# EAGLE design robot (EAGLE 9.2.2)
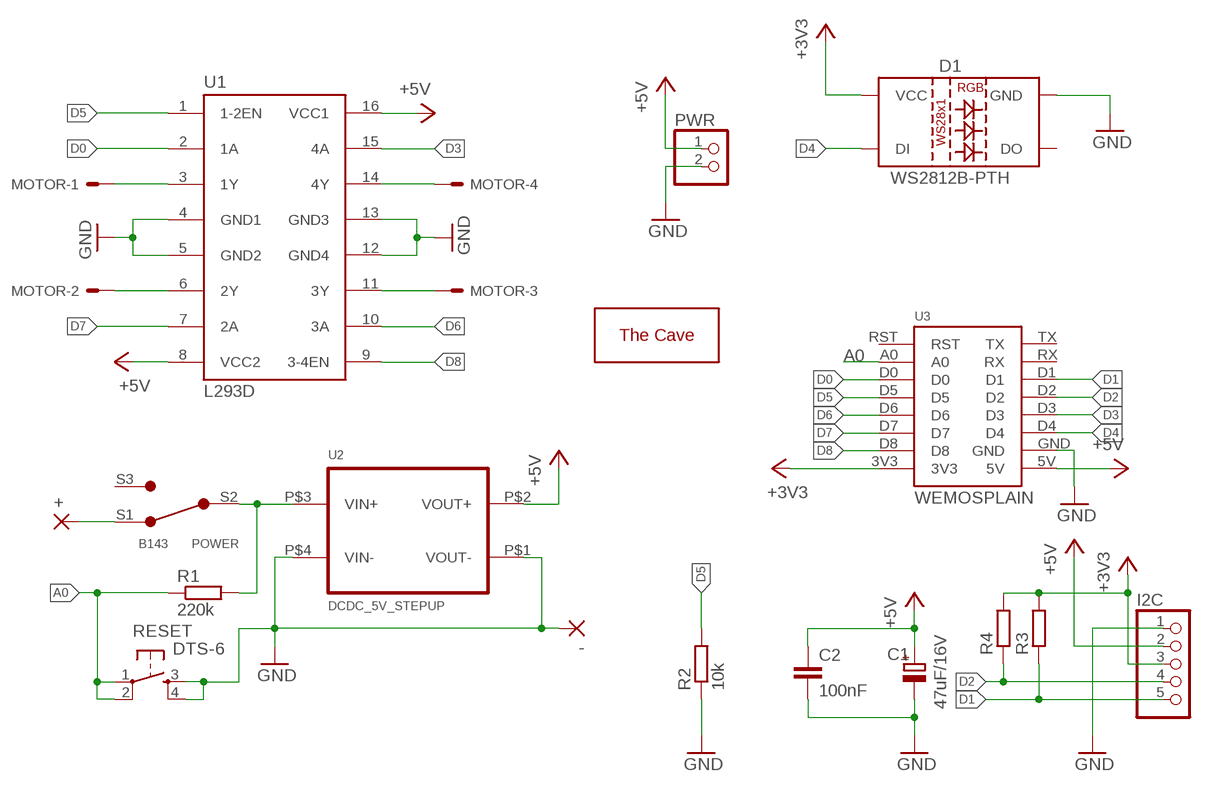
[diagram p0: schematic, sheet 1]

## Parts
+  2,54/0,8  [2,54/0,8]
-  2,54/0,8  [2,54/0,8]
C1  47uF/16V  CPOL-EUE2.5-7  [E2,5-7]
C2  100nF  C-EU025-025X050  [C025-025X050]
D1  WS2812B-PTH  [WS2812B-PTH-KIT]
I2C  PINHD-1X5  [1X05]
MOTOR  JST-XH-04-PIN-LONG-PAD  [JST-XH-04-PACKAGE-LONG-PAD]
POWER  B143  [B143]
PWR  PINHD-1X2  [1X02]
R1  220k  R-EU_0204/5  [0204/5]
R2  10k  R-EU_0204/5  [0204/5]
R3  R-EU_R0805  [R0805]
R4  R-EU_R0805  [R0805]
RESET  DTS-6  [DTS-6]
U1  L293D  [DIL16]
U2  DCDC_5V_STEPUP  [DCDC_5V_STEPUP]
U3  WEMOSPLAIN  [WEMOS-PLAIN]
U$1  THECAVE_LOGO_NEW_TOP_SMALL  [NEW_LOGO_SMALL_TOP]

## Nets
+3V3: D1.3-VCC(VCC) I2C.3 R3.2 R4.2 U3.3V3
+5V: C1.+ C2.1 I2C.2 PWR.1 U1.8(VCC2) U1.16(VCC1) U2.P$2(VOUT+) U3.5V
A0: R1.1 RESET.1 RESET.2 U3.A0
D0: U1.2(1A) U3.D0
D1: I2C.5 R3.1 U3.D1
D2: I2C.4 R4.1 U3.D2
D3: U1.15(4A) U3.D3
D4: D1.1-IN(DI) U3.D4
D5: R2.2 U1.1(1-2EN) U3.D5
D6: U1.10(3A) U3.D6
D7: U1.7(2A) U3.D7
D8: U1.9(3-4EN) U3.D8
GND: -.1(P) C1.- C2.2 D1.2-GND(GND) I2C.1 PWR.2 R2.1 RESET.3 RESET.4 U1.4(GND1) U1.5(GND2) U1.12(GND4) U1.13(GND3) U2.P$1(VOUT-) U2.P$4(VIN-) U3.GND
N$1: MOTOR.1 U1.3(1Y)
N$2: MOTOR.2 U1.6(2Y)
N$3: MOTOR.3 U1.11(3Y)
N$4: MOTOR.4 U1.14(4Y)
N$7: POWER.S2(COM) R1.2 U2.P$3(VIN+)
N$8: +.1(P) POWER.S1
Unconnected: D1.4-OUT(DO) POWER.S3(S2) U3.RST U3.RX U3.TX

## Library data of the parts
+ - = wirepad:2,54/0,8: THROUGH-HOLE PAD
C1 = rcl:CPOL-EU: POLARIZED CAPACITOR, European symbol; SPICEPREFIX: C
C2 = rcl:C-EU: CAPACITOR, European symbol; SPICEPREFIX: C
D1 = thecave:WS2812B-PTH: WS2812 THT led 5mm https://www.aliexpress.com/item/RGB-LED-chips-DC5V-Diffused-round-hat-with-WS2811-PL9823-APA106-chipset-inside-F5-5mm-F8/32855805886.html
I2C = pinhead:PINHD-1X5: PIN HEADER
MOTOR = Rembrandt Electronics - JST XH Connectors v1-0:JST-XH-04-PIN: JST XH Connector 2 Pin Wire to board connector. Pitch: 2,54 mm, (0.100") Number of pins: 4 Created by Rembrandt Electronics www.rembrandtelectronics.com
POWER = thecave:B143: One pole slide switch, through hole mount https://www.gme.cz/p-b143-1 https://www.gme.cz/b143
PWR = pinhead:PINHD-1X2: PIN HEADER
R1-R4 = rcl:R-EU_: RESISTOR, European symbol; SPICEPREFIX: R
RESET = switch-tact:DTS-6
U1 = st-microelectronics:L293D: PUSH-PULL 4 CHANNEL DRIVER; MPN: L293D; OC_FARNELL: 9589619; OC_NEWARK: 56P8249
U2 = thecave:DCDC_5V_STEPUP: DC-DC 5V stepup module https://www.aliexpress.com/item/ESP8266-ESP-01-ESP01-Serial-Wireless-WIFI-Module-For-Arduino-Transceiver-Receiver-Board-For-Arduino-Raspberry/32818329744.html
U3 = d1-mini:WEMOS
U$1 = thecave:THECAVE_LOGO: The Cave DIY workshop logos thecave.cz

## Board
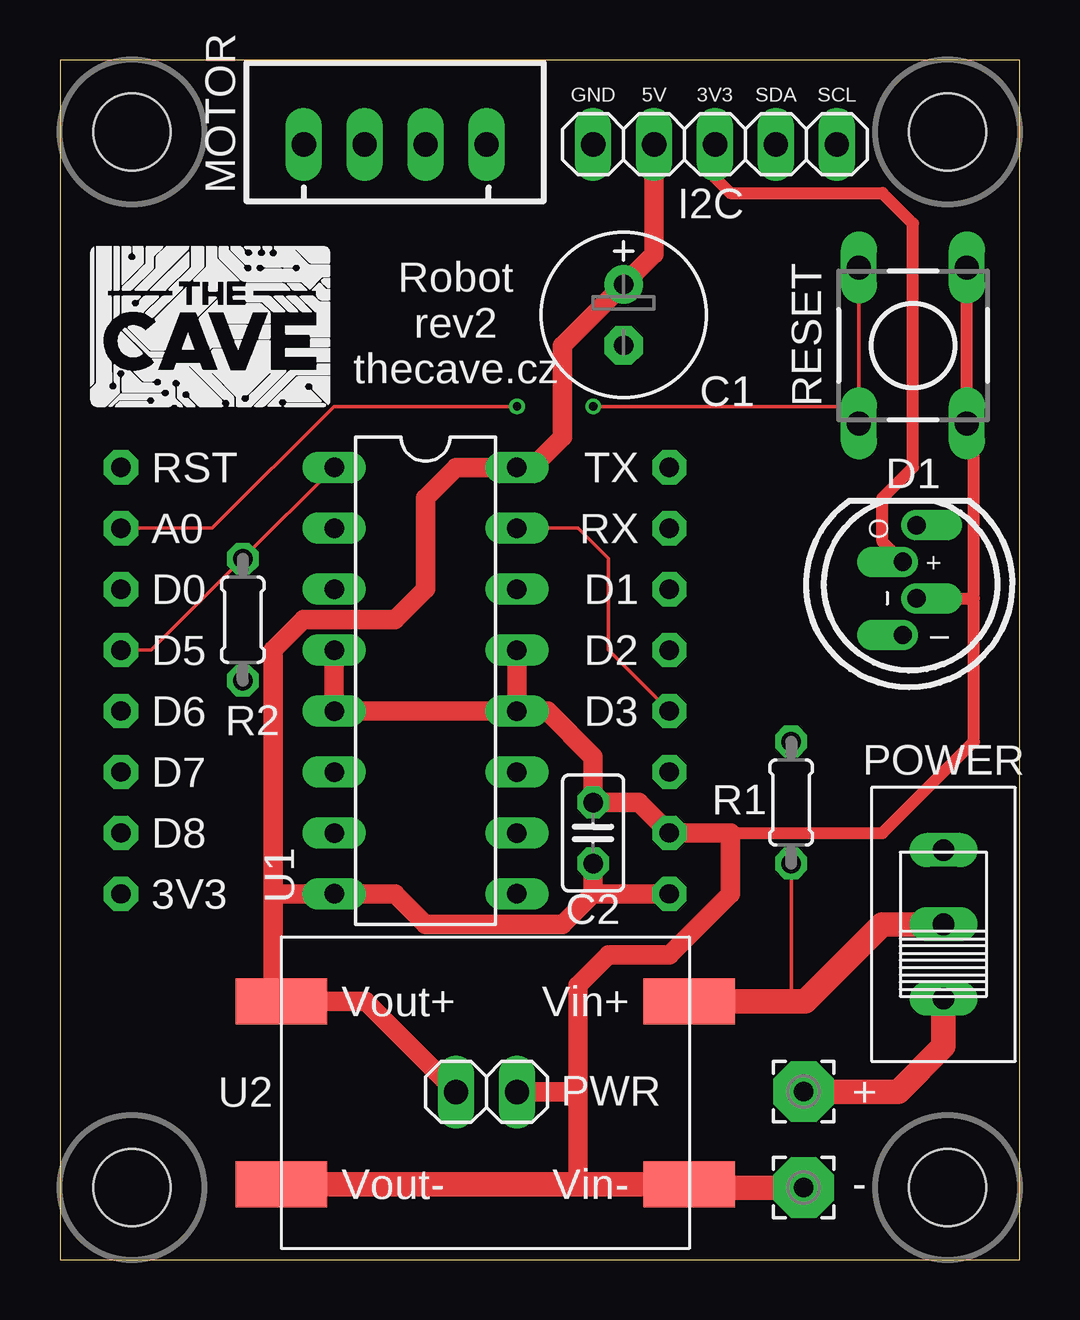
[diagram p1: board, top side]
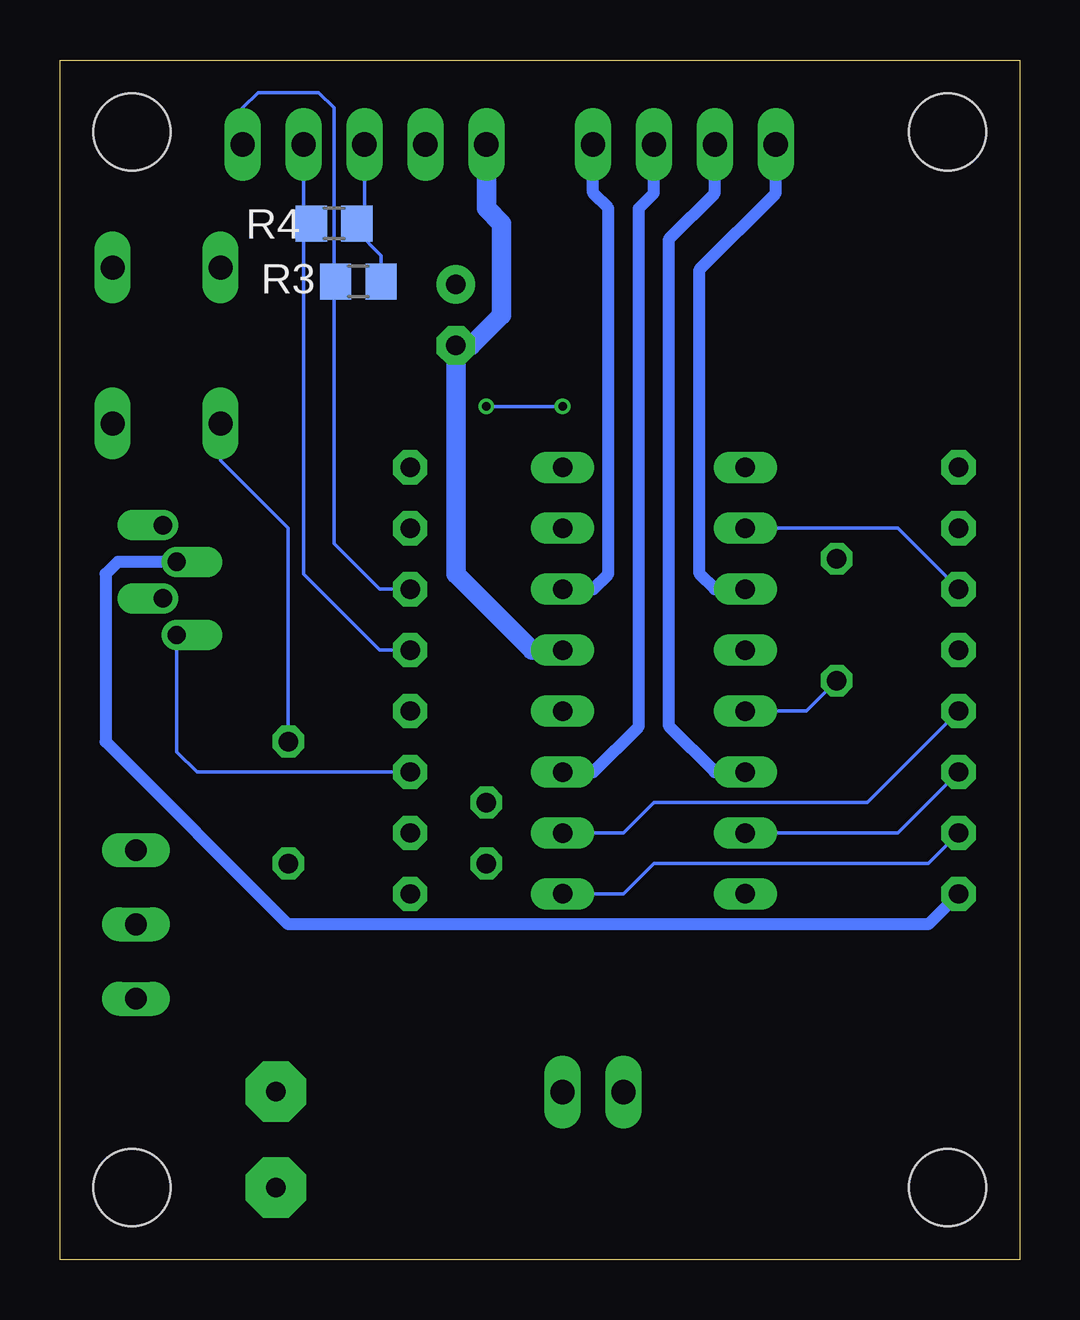
[diagram p2: board, bottom side, seen from below]

Size 40 x 50 mm. Coordinates in mm from the lower left corner, seen from the top.
Outline: 0,0 40,0 40,50 0,50 0,0
Copper layers (1*16): Top 0.035mm / dielectric 1.5mm / Bottom 0.035mm
Design rules "SeeedStudio_2layer_DRU_no_angle_20140221": minimum track width 6mil, minimum drill 12mil, track to track 6mil, track to pad 6mil, pad to pad 6mil, via to via 6mil, smd to smd 0mil, copper to edge 10mil, drill to drill 10mil, minimum pad ring 10mil, minimum via ring 6mil, stop-mask expansion 2mil, vias tented up to drill 100mil, thermal gap 10mil
Holes 3.2 mm at 3,47 37,47 3,3 37,3

### Footprints (pad centres in the part's own frame; a part is rotated, then mirrored left to right if it is on the bottom)
2,54/0,8 = drill 0.813 pad 2.54 octagon: 1 0,0
E2,5-7 = drill 0.813 pad 1.6: + -1.27,0 | drill 0.813 pad 1.6 octagon: - 1.27,0
C025-025X050 = drill 0.813 octagon: 1 -1.27,0; 2 1.27,0
WS2812B-PTH-KIT = drill 0.762 pad 1.27 offset: 1-IN 2.413,0.079; 2-GND 0.889,0.651; 3-VCC -0.635,0.079; 4-OUT -2.159,0.651
1X05 = drill 1.016 long: 1 -5.08,0; 2 -2.54,0; 3 0,0; 4 2.54,0; 5 5.08,0
JST-XH-04-PACKAGE-LONG-PAD = drill 1.016 long: 1 -3.81,0; 2 -1.27,0; 3 1.27,0; 4 3.81,0
B143 = drill 0.9 long: S1 -3.1,0; S2 0,0; S3 3.1,0
1X02 = drill 1.016 long: 1 -1.27,0; 2 1.27,0
0204/5 = drill 0.813 octagon: 1 -2.54,0; 2 2.54,0
R0805 = smd 1.3 x 1.5: 1 -0.95,0; 2 0.95,0
DTS-6 = drill 1 long: 1 -3.25,2.25; 2 3.25,2.25; 3 -3.25,-2.25; 4 3.25,-2.25
DIL16 = drill 0.813 long: 1 -8.89,-3.81; 2 -6.35,-3.81; 3 -3.81,-3.81; 4 -1.27,-3.81; 5 1.27,-3.81; 6 3.81,-3.81; 7 6.35,-3.81; 8 8.89,-3.81; 9 8.89,3.81; 10 6.35,3.81; 11 3.81,3.81; 12 1.27,3.81; 13 -1.27,3.81; 14 -3.81,3.81; 15 -6.35,3.81; 16 -8.89,3.81
DCDC_5V_STEPUP = smd 3.81 x 1.905: P$1 -8.5,-3.81; P$2 -8.5,3.81; P$3 8.5,3.81; P$4 8.5,-3.81
WEMOS-PLAIN = drill 0.8 pad 1.422 octagon: 3V3 0,0; 5V 22.86,0; A0 0,15.24; D0 0,12.7; D1 22.86,12.7; D2 22.86,10.16; D3 22.86,7.62; D4 22.86,5.08; D5 0,10.16; D6 0,7.62; D7 0,5.08; D8 0,2.54; GND 22.86,2.54; RST 0,17.78; RX 22.86,15.24; TX 22.86,17.78

### Placement (x,y rotation side)
+  31,7 0 top
-  31,3 0 top
C1  23.5,39.37 270 top
C2  22.23,17.78 90 top
D1  35.05,28.45 270 top
I2C  27.3,46.48 0 top
MOTOR  13.97,46.48 0 top
POWER  36.83,13.97 90 top
PWR  17.78,6.99 0 top
R1  30.48,19.05 270 top
R2  7.62,26.67 90 top
R3  27.56,40.77 0 bottom
R4  28.57,43.18 0 bottom
RESET  35.56,38.1 90 top
U1  15.24,24.13 270 top
U2  17.73,6.95 0 top
U3  2.54,15.24 0 top
U$1  1.27,35.56 0 top

### Tracks (layer width: path | path; a pad name or v marks a point on that pad's centre or on a via)
+3V3
  Top 0.508: D1.3-VCC 34.29,29.92 34.29,31.75 35.56,33.02 35.56,43.18 34.29,44.45 27.94,44.45 27.3,45.09 I2C.3
  Bottom 0.152: I2C.3 27.3,43.5 R4.2 27.62,42.87 26.61,41.85 R3.2
  Bottom 0.508: U3.3V3 3.81,13.97 30.48,13.97 38.1,21.59 38.1,28.57 37.59,29.08 D1.3-VCC
+5V
  Top 0.813: 8.89,11.1 8.89,15.24 | 8.89,15.24 U1.8 13.97,15.24 15.24,13.97 20.95,13.97 22.23,15.24 | 8.89,15.24 8.89,25.4 10.16,26.67 13.97,26.67 15.24,27.94 15.24,31.75 16.51,33.02 U1.16 19.68,33.02 20.95,34.29 20.95,38.1 C1.+ 24.77,41.91 I2C.2 | 22.23,15.24 U3.5V | 22.23,15.24 C2.1 | U2.P$2 12.73,10.76 PWR.1
  Top 1.016: U2.P$2 8.89,11.1
A0  (via drill 0.35)
  Top 0.152: RESET.2 RESET.1 33.31,35.27 33.02,35.56 v22.23,35.56 | U3.A0 6.35,30.48 11.43,35.56 v19.05,35.56
  Bottom 0.152: RESET.1 33.31,33.31 30.48,30.48 R1.1 | v19.05,35.56 v22.23,35.56
D0
  Bottom 0.152: U3.D0 5.08,30.48 U1.2
D1
  Bottom 0.152: U3.D1 26.67,27.94 28.57,29.84 28.57,40.64 28.57,40.7 | 28.57,40.7 28.57,48.01 29.21,48.64 31.75,48.64 32.38,48.01 I2C.5 | R3.1 28.57,40.7
D2
  Bottom 0.152: U3.D2 26.67,25.4 29.84,28.57 29.84,43.18 | 29.84,43.18 I2C.4 | R4.1 29.84,43.18
D3
  Top 0.152: U3.D3 22.86,25.4 22.86,29.21 21.59,30.48 U1.15
D4
  Bottom 0.152: D1.1-IN 35.13,21.16 34.29,20.32 U3.D4
D5
  Top 0.152: U3.D5 3.81,25.4 R2.2 U1.1
D6
  Bottom 0.152: U3.D6 6.35,19.05 15.24,19.05 16.51,17.78 U1.10
D7
  Bottom 0.152: U1.7 5.08,17.78 U3.D7
D8
  Bottom 0.152: U3.D8 3.81,16.51 15.24,16.51 16.51,15.24 U1.9
GND
  Top 0.508: 27.94,17.78 34.29,17.78 38.1,21.59 38.1,27.56 | 38.1,27.56 38.1,34.56 RESET.3 RESET.4 | D1.2-GND 38.1,27.56
  Top 0.813: 21.59,6.99 21.59,3.14 | U1.12 20.32,22.86 22.23,20.95 C2.2 24.13,19.05 U3.GND 27.94,17.78 27.94,15.24 25.4,12.7 22.86,12.7 21.59,11.43 21.59,7.62 21.59,6.99 | U1.12 U1.5 U1.4 | U1.13 U1.12 | PWR.2 21.59,6.99
  Top 1.016: U2.P$1 21.59,3.14 U2.P$4 26.37,3 -.1
  Bottom 0.152: R2.1 8.89,22.86 U1.5
  Bottom 0.813: U1.13 20.32,25.4 23.5,28.57 C1.- 22.86,38.1 21.59,39.37 21.59,43.18 22.23,43.81 I2C.1
N$1
  Bottom 0.508: U1.3 12.7,27.94 13.34,28.57 13.34,41.27 10.16,44.45 MOTOR.1
N$2
  Bottom 0.508: U1.6 12.7,20.32 14.61,22.23 14.61,42.55 12.7,44.45 MOTOR.2
N$3
  Bottom 0.508: U1.11 17.78,20.32 15.88,22.23 15.88,43.81 15.24,44.45 MOTOR.3
N$4
  Bottom 0.508: U1.14 17.78,27.94 17.14,28.57 17.14,43.81 17.78,44.45 MOTOR.4
N$7
  Top 0.152: R1.2 30.48,10.76
  Top 1.016: U2.P$3 30.48,10.76 31.08,10.76 34.29,13.97 POWER.S2
N$8
  Top 1.016: +.1 34.94,7 36.83,8.89 POWER.S1

### Text on the board
tPlace: GND | 5V | 3V3 | SDA | SCL | Robot / rev2 / thecave.cz | RST | TX | A0 | RX | D0 | D1 | D5 | D2 | D6 | D3 | D7 | D8 | 3V3